# Altium schematic sheet Microcontroller.SchDoc
size A4; SheetNumber: 3; SheetTotal: 5
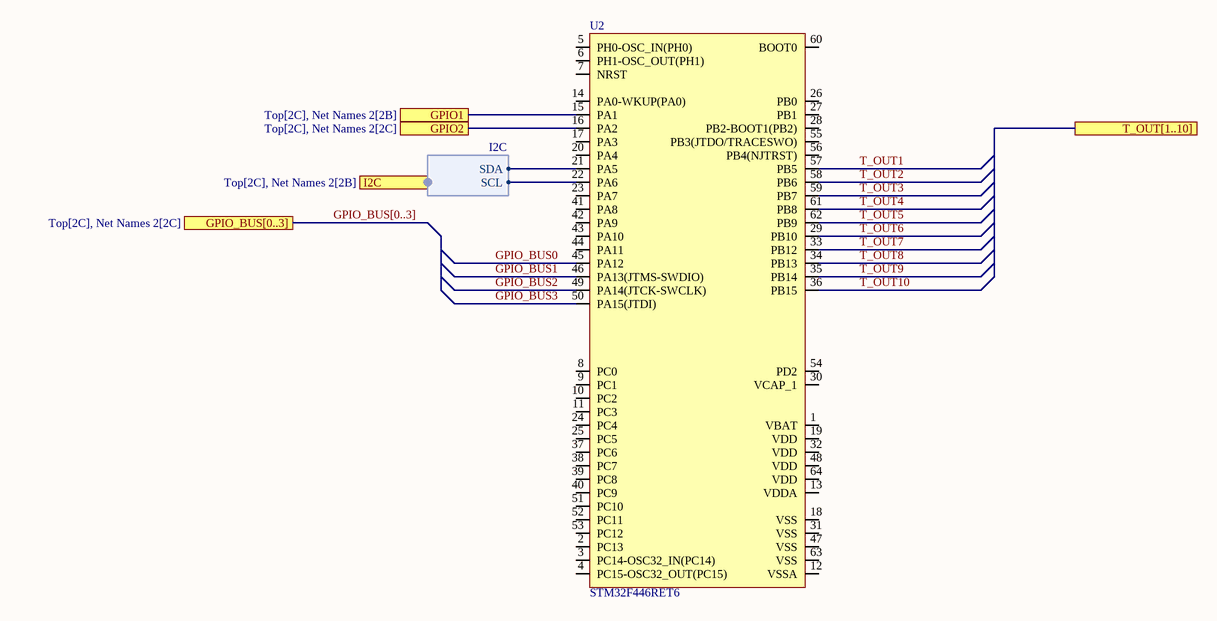
[diagram p0: Microcontroller.SchDoc]

## Parts
U2  STM32F446RET6  [STM_LQFP64_N]

## Ports
GPIO1 (see Top[2C], Net Names 2[2B]), GPIO2 (see Top[2C], Net Names 2[2C]), GPIO_BUS[0..3] (see Top[2C], Net Names 2[2C]), I2C (harness I2C, see Top[2C], Net Names 2[2B]), T_OUT[1..10]

## Harnesses
I2C: SDA, SCL

## Nets
GPIO1: U2.15(PA1) ; port GPIO1
GPIO2: U2.16(PA2) ; port GPIO2
GPIO_BUS0: U2.45(PA12)
GPIO_BUS1: U2.46(PA13(JTMS-SWDIO))
GPIO_BUS2: U2.49(PA14(JTCK-SWCLK))
GPIO_BUS3: U2.50(PA15(JTDI))
T_OUT1: U2.57(PB5)
T_OUT2: U2.58(PB6)
T_OUT3: U2.59(PB7)
T_OUT4: U2.61(PB8)
T_OUT5: U2.62(PB9)
T_OUT6: U2.29(PB10)
T_OUT7: U2.33(PB12)
T_OUT8: U2.34(PB13)
T_OUT9: U2.35(PB14)
T_OUT10: U2.36(PB15)
NetU2_21: U2.21(PA5) ; port I2C.SDA
NetU2_22: U2.22(PA6) ; port I2C.SCL

Not connected (* = marked no-connect by the designer): U2 1(VBAT) 2(PC13) 3(PC14-OSC32_IN(PC14)) 4(PC15-OSC32_OUT(PC15)) 5(PH0-OSC_IN(PH0)) 6(PH1-OSC_OUT(PH1)) 7(NRST) 8(PC0) 9(PC1) 10(PC2) 11(PC3) 12(VSSA) 13(VDDA) 14(PA0-WKUP(PA0)) 17(PA3) 18(VSS) 19(VDD) 20(PA4) 23(PA7) 24(PC4) 25(PC5) 26(PB0) 27(PB1) 28(PB2-BOOT1(PB2)) 30(VCAP_1) 31(VSS) 32(VDD) 37(PC6) 38(PC7) 39(PC8) 40(PC9) 41(PA8) 42(PA9) 43(PA10) 44(PA11) 47(VSS) 48(VDD) 51(PC10) 52(PC11) 53(PC12) 54(PD2) 55(PB3(JTDO/TRACESWO)) 56(PB4(NJTRST)) 60(BOOT0) 63(VSS) 64(VDD)

## Buses and harness runs
bus GPIO_BUS[0..3] = port GPIO_BUS[0..3]

## Library data of the parts
U2 = STM32F446RET6: IC MCU 32BIT 512KB FLASH 64LQFP; Manufacturer 1: STMicroelectronics; Manufacturer Part Number 1: LF80CDT-TR; Supplier 1: Digi-Key; Supplier Part Number 1: 497-15376-ND